# Altium schematic sheet [001] USB.SchDoc
size A4
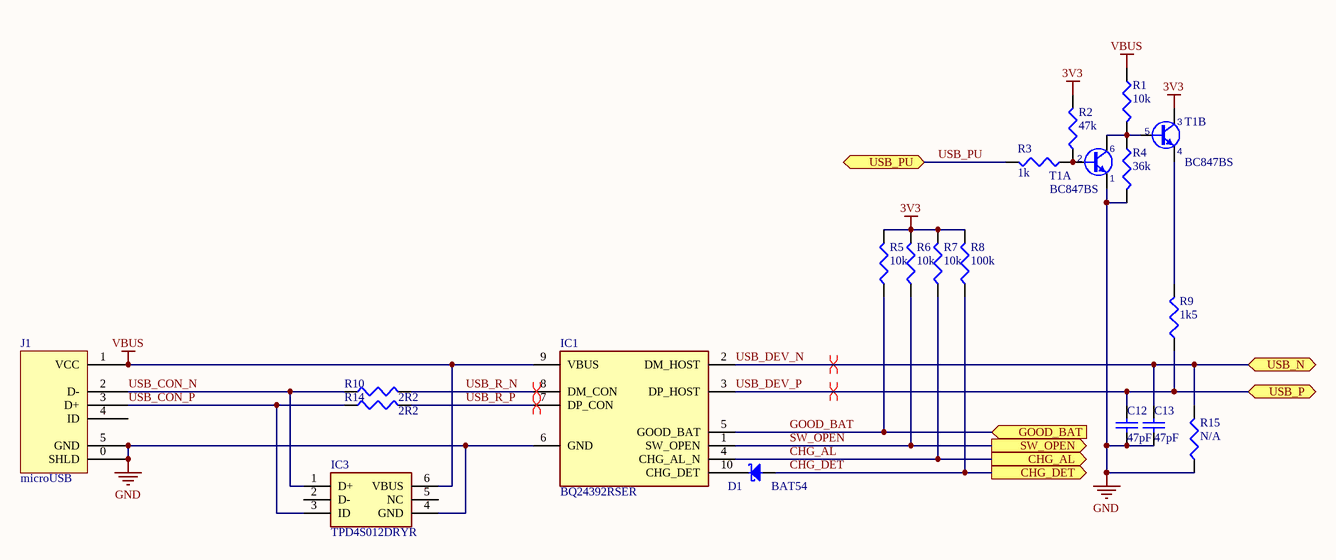
[diagram p0: [001] USB.SchDoc]

## Parts
C12  value 47pF  [1608[0603]]  (hidden comment: Cap Semi)
C13  value 47pF  [1608[0603]]  (hidden comment: Cap Semi)
D1  BAT54  [SOT95P240X130-3N]
IC1  BQ24392RSER  [RSE(R-PUQFN-N10)]
IC3  TPD4S012DRYR  [SON50P100X145X60-6N]
J1  microUSB  [UB-MC5BR3-SDWP604-4S - custom]
R1  value 10k  [J1-0603]  (hidden comment: Res3)
R2  value 47k  [J1-0603]  (hidden comment: Res3)
R3  value 1k  [J1-0603]  (hidden comment: Res3)
R4  value 36k  [J1-0603]  (hidden comment: Res3)
R5  value 10k  [J1-0603]  (hidden comment: Res3)
R6  value 10k  [J1-0603]  (hidden comment: Res3)
R7  value 10k  [J1-0603]  (hidden comment: Res3)
R8  value 100k  [J1-0603]  (hidden comment: Res3)
R9  value 1k5  [J1-0603]  (hidden comment: Res3)
R10  value 2R2  [J1-0603]  (hidden comment: Res3)
R14  value 2R2  [J1-0603]  (hidden comment: Res3)
R15  Res3  [J1-0603]  (value not drawn)
T1  BC847BS  [SOT65P210X110-6N]  (parts A,B of 2)

## Ports
CHG_AL (out), CHG_DET (out), GOOD_BAT (in), SW_OPEN (out), USB_N (bidir), USB_P (bidir), USB_PU (bidir)

## Nets
3V3: R2.2 R5.2 R6.2 R7.2 R8.2 T1.3(C)
GND: C12.2 C13.2 IC1.6(GND) IC3.4(GND) J1.0(SHLD) J1.5(GND) R4.2 R15.1 T1.1(E)
VBUS: IC1.9(VBUS) IC3.6(VBUS) J1.1(VCC) R1.1
CHG_AL: IC1.4(CHG_AL_N) R7.1 ; port CHG_AL
CHG_DET: D1.1(A) R8.1 ; port CHG_DET
GOOD_BAT: IC1.5(GOOD_BAT) R5.1 ; port GOOD_BAT
SW_OPEN: IC1.1(SW_OPEN) R6.1 ; port SW_OPEN
USB_CON_N: IC3.1(D+) J1.2(D-) R10.1
USB_CON_P: IC3.3(ID) J1.3(D+) R14.1
USB_DEV_N: C13.1 IC1.2(DM_HOST) R15.2 ; port USB_N
USB_DEV_P: C12.1 IC1.3(DP_HOST) R9.1 ; port USB_P
USB_PU: R3.2 ; port USB_PU
USB_R_N: IC1.8(DM_CON) R10.2
USB_R_P: IC1.7(DP_CON) R14.2
NetD1_3: D1.3(C) IC1.10(CHG_DET)
NetR1_2: R1.2 R4.1 T1.5(B) T1.6(C)
NetR2_1: R2.1 R3.1 T1.2(B)
NetR9_2: R9.2 T1.4(E)

Not connected (* = marked no-connect by the designer): IC3 2(D-) 5(NC); J1 4(ID)

## Layout directives
differential pair: USB_DEV_N, USB_DEV_P, USB_R_N, USB_R_P

## Library data of the parts
C12 C13 = Cap Semi: Capacitor (Semiconductor SIM Model); Published: 8-Jun-2000; LatestRevisionDate: 29-May-2009; LatestRevisionNote: IPC-7351 Footprint Added.; PackageReference: C1206; Publisher: Altium Limited; PackageDescription: Chip Capacitor
D1 = BAT54: Diode Schottky  Anode Pin 1 Cathode Pin 3 (Pas de pin 2); Part Description: Single Small Signal Schottky Diode; Manufacturer: FAIRCHILD SEMICONDUCTOR; Voltage: 30V; Power: 200mA; PressFit: No; Bonding: No; Part Number: BAT54; Component Kind: Standard; Component Type: Standard; Device: BAT54; PackageDescription: SOT23 3-Leads, Pitch 0.95mm - Body 1.3x2.9mm, IPC Medium Density; Manufacturer Part Number: BAT54; Pin Count: 3; Case: SOT23-3; Mounted: Yes; Socket: No; SMD: Yes; Sense: No; ComponentHeight: 1.30mm; HelpURL: \\cern.ch\dfs\Applications\Altium\Datasheets\BAT54.pdf; Author: CERN DEM JLC; CreateDate: 17.09.2009; LatestRevisionDate: 27.05.2010
IC1 = BQ24392RSER: Integrated Circuit; Manufacturer_Name: Texas Instruments; Datasheet Link: http://www.ti.com/lit/gpn/bq24392; Manufacturer_Part_Number: BQ24392RSER; Mouser Part Number: 595-BQ24392RSER; Mouser Price/Stock: https://www.mouser.com/Search/Refine.aspx?Keyword=595-BQ24392RSER; RS Part Number: 8279327; RS Price/Stock: http://uk.rs-online.com/web/p/products/8279327
IC3 = TPD4S012DRYR: Integrated Circuit; Manufacturer_Name: Texas Instruments; Datasheet Link: http://www.ti.com/lit/ds/symlink/tpd4s012.pdf; Height: 0.6mm; Mouser2 Part Number: 595-TPD4S012DRYR; Mouser2 Price/Stock: https://www.mouser.com/Search/Refine.aspx?Keyword=595-TPD4S012DRYR; Manufacturer_Part_Number: TPD4S012DRYR
J1 = microUSB: microUSB connector
R1-R10 R14 R15 = Res3: Resistor; Published: 8-Jun-2000; LatestRevisionDate: 29-May-2009; LatestRevisionNote: IPC-7351 Footprint Added.; PackageReference: J1-0603; Publisher: Altium Limited; PackageDescription: Chip Resistor
  R15: Value: N/A
T1 = BC847BS: 45V 100mA Dual NPN General-Purpose Transistor; Manufacturer: NXP SEMICONDUCTORS; PressFit: No; Bonding: No; Part Number: BC847BS; Component Kind: Standard; Component Type: Standard; Device: BC847BS; PackageDescription: SOT363, SC-88, SOT, 0.65mm Pitch, 6 pin, 1.25mm W X 2.00mm L X 1.10mm H, IPC Medium Density; Part Description: 45V 100mA Dual NPN General-Purpose Transistor; Manufacturer Part Number: BC847BS; Pin Count: 6; Case: SOT363; Mounted: Yes; Socket: No; SMD: Yes; Sense: No; ComponentHeight: 1.1mm; HelpURL: \\cern.ch\dfs\Applications\Altium\Datasheets\BC847BS.pdf; Author: CERN DEM JMW; CreateDate: 10.07.2015; LatestRevisionDate: 10.07.2015